# EAGLE design atmega2560 (EAGLE 6.1)
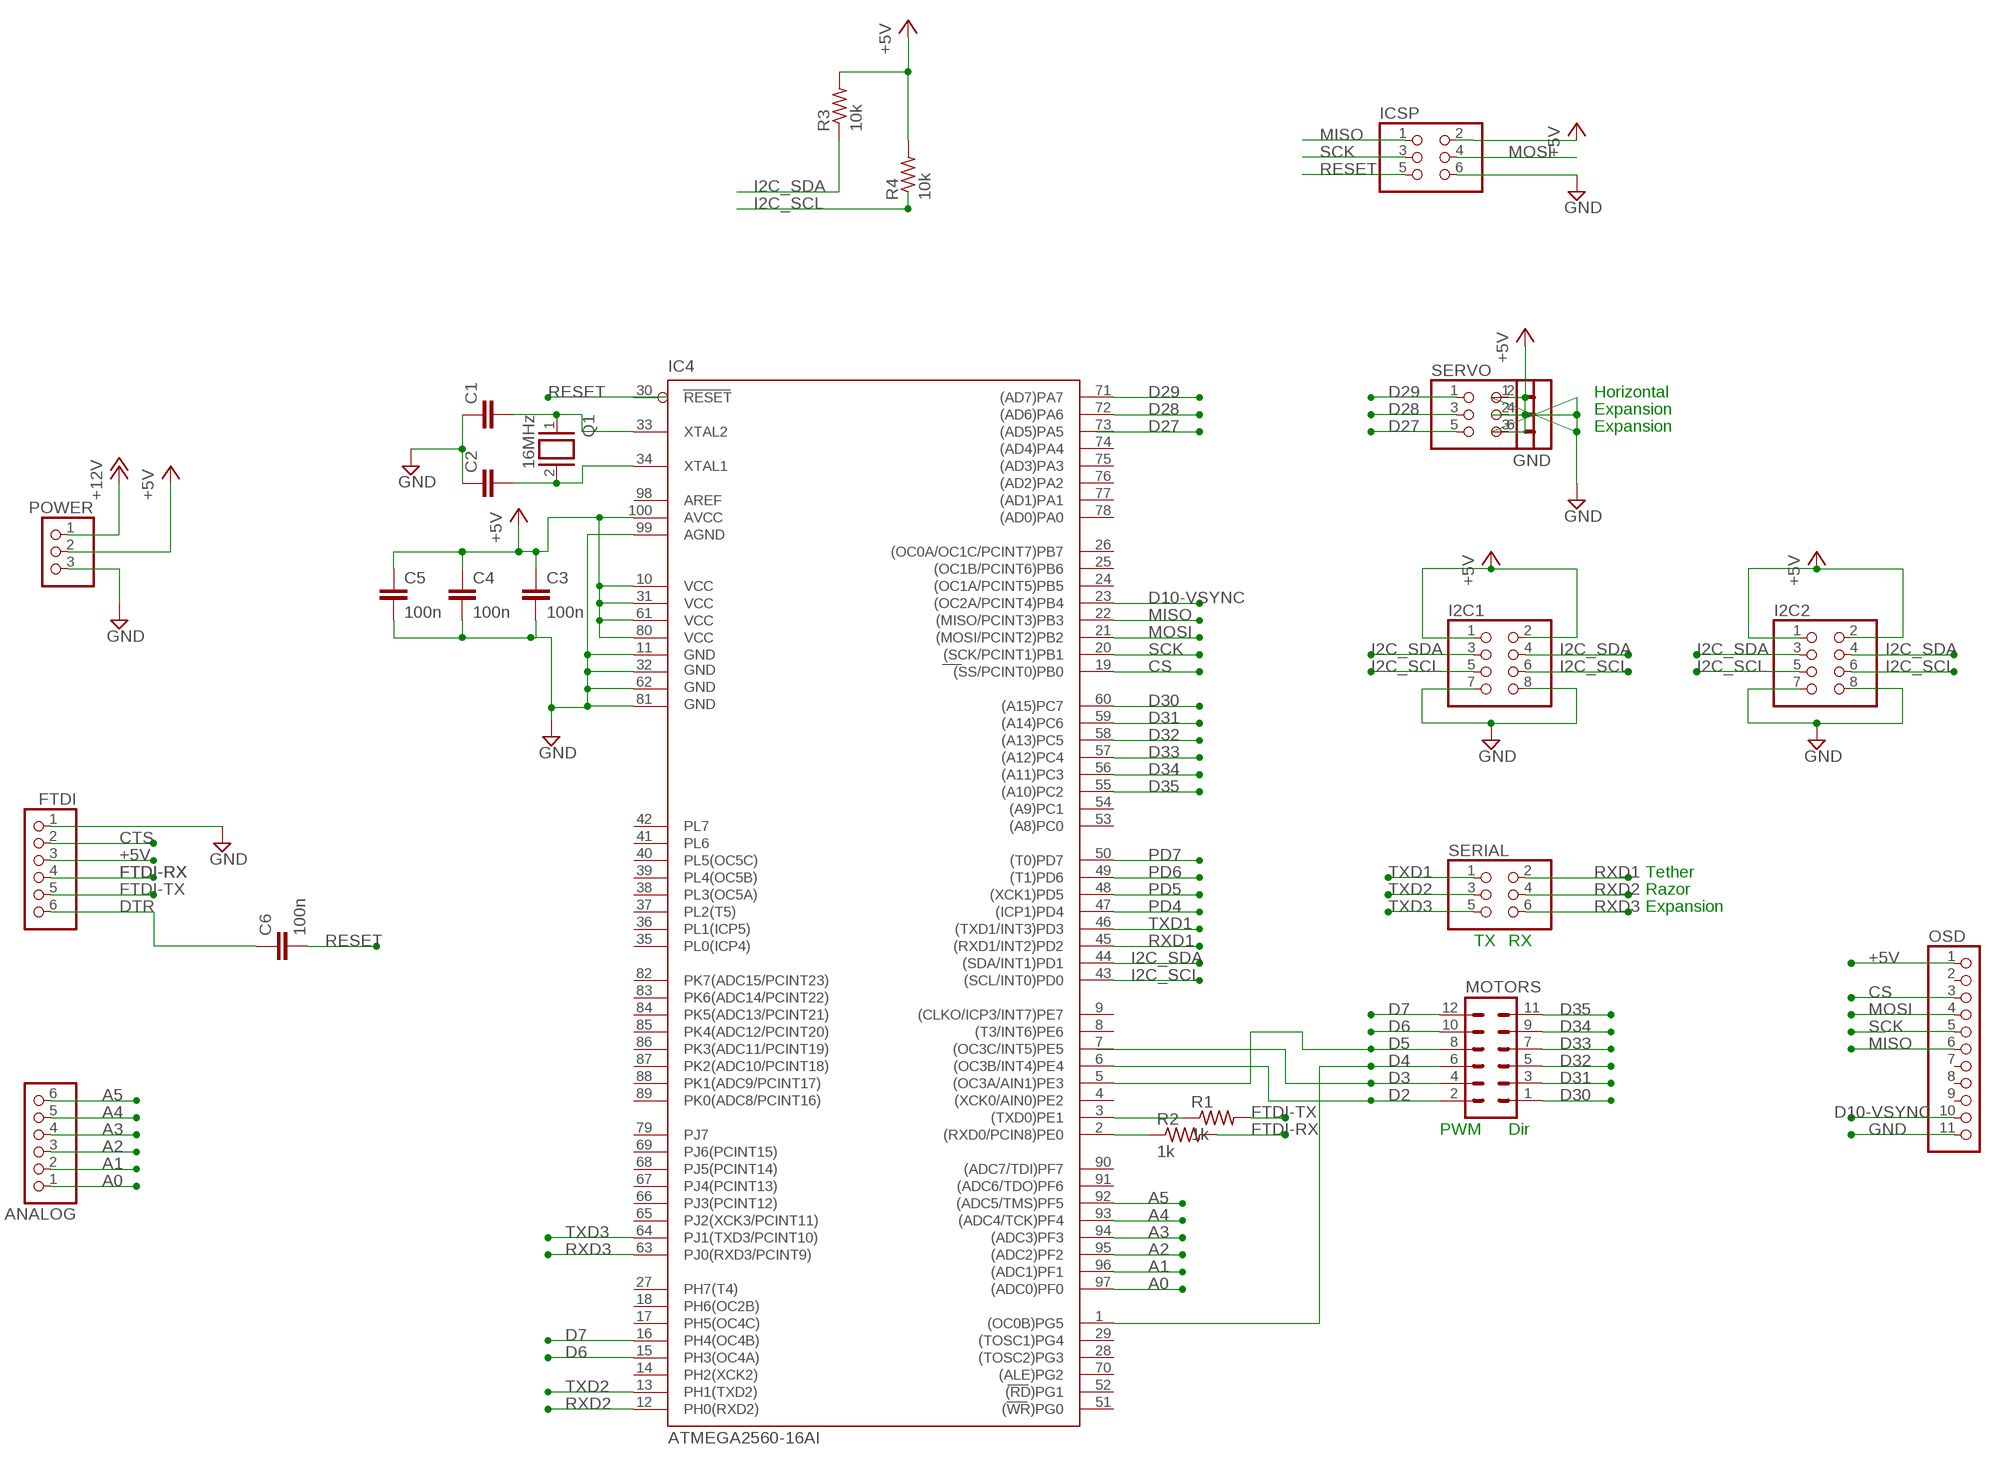
[diagram p0: schematic, sheet 1]

## Parts
ANALOG  PINHD-1X6  [1X06]
C1  C5/3.5  [C5B3.5]
C2  C5/3.5  [C5B3.5]
C3  100n  C5/3.5  [C5B3.5]
C4  100n  C5/3.5  [C5B3.5]
C5  100n  C5/3.5  [C5B3.5]
C6  100n  C-EU050-030X075  [C050-030X075]
FTDI  PINHD-1X6  [1X06]
GND  MA03-1  [MA03-1]
I2C1  PINHD-2X4  [2X04]
I2C2  PINHD-2X4  [2X04]
IC4  ATMEGA2560-16AI  [TQFP100]
ICSP  PINHD-2X3  [2X03]
MOTORS  MA06-2  [MA06-2]
OSD  PINHD-1X11  [1X11]
POWER  PINHD-1X3  [1X03]
Q1  16MHz  XTAL/S  [QS]
R1  1k  R-US_0207/7  [0207/7]
R2  1k  R-US_0207/7  [0207/7]
R3  10k  R-US_0207/7  [0207/7]
R4  10k  R-US_0207/7  [0207/7]
SERIAL  PINHD-2X3  [2X03]
SERVO  PINHD-2X3  [2X03]

## Nets
+5V: C3.1 C4.1 C5.1 FTDI.3 I2C1.1 I2C1.2 I2C2.1 I2C2.2 IC4.10(VCC) IC4.31(VCC1) IC4.61(VCC2) IC4.80(VCC3) IC4.100(AVCC) ICSP.2 OSD.1 POWER.2 R3.2 R4.2 SERVO.2 SERVO.4 SERVO.6
+12V: POWER.1
A0: ANALOG.1 IC4.97((ADC0)PF0)
A1: ANALOG.2 IC4.96((ADC1)PF1)
A2: ANALOG.3 IC4.95((ADC2)PF2)
A3: ANALOG.4 IC4.94((ADC3)PF3)
A4: ANALOG.5 IC4.93((ADC4/TCK)PF4)
A5: ANALOG.6 IC4.92((ADC5/TMS)PF5)
CS: IC4.19((SS/PCINT0)PB0) OSD.3
CTS: FTDI.2
D2: IC4.6((OC3B/INT4)PE4) MOTORS.2
D3: MOTORS.4
D4: IC4.1((OC0B)PG5) MOTORS.6
D5: IC4.5((OC3A/AIN1)PE3) MOTORS.8
D6: IC4.15(PH3(OC4A)) MOTORS.10
D7: IC4.16(PH4(OC4B)) MOTORS.12
D10-VSYNC: IC4.23((OC2A/PCINT4)PB4) OSD.10
D27: SERVO.5
D28: IC4.72((AD6)PA6) SERVO.3
D29: IC4.71((AD7)PA7) SERVO.1
D30: IC4.60((A15)PC7) MOTORS.1
D31: IC4.59((A14)PC6) MOTORS.3
D32: IC4.58((A13)PC5) MOTORS.5
D33: IC4.57((A12)PC4) MOTORS.7
D34: IC4.56((A11)PC3) MOTORS.9
D35: IC4.55((A10)PC2) MOTORS.11
DTR: C6.1 FTDI.6
FTDI-RX: FTDI.4 R2.2
FTDI-TX: FTDI.5 R1.2
GND: C1.1 C2.1 C3.2 C4.2 C5.2 FTDI.1 GND.1 GND.2 GND.3 I2C1.7 I2C1.8 I2C2.7 I2C2.8 IC4.11(GND) IC4.32(GND1) IC4.62(GND2) IC4.81(GND3) IC4.99(AGND) ICSP.6 OSD.11 POWER.3
I2C_SCL: I2C1.5 I2C1.6 I2C2.5 I2C2.6 IC4.43((SCL/INT0)PD0) R4.1
I2C_SDA: I2C1.3 I2C1.4 I2C2.3 I2C2.4 IC4.44((SDA/INT1)PD1) R3.1
MISO: IC4.22((MISO/PCINT3)PB3) ICSP.1 OSD.6
MOSI: IC4.21((MOSI/PCINT2)PB2) ICSP.4 OSD.4
N$1: C1.2 IC4.33(XTAL2) Q1.1
N$2: C2.2 IC4.34(XTAL1) Q1.2
N$3: IC4.2((RXD0/PCIN8)PE0) R2.1
N$4: IC4.3((TXD0)PE1) R1.1
PD4: IC4.47((ICP1)PD4)
PD5: IC4.48((XCK1)PD5)
PD6: IC4.49((T1)PD6)
PD7: IC4.50((T0)PD7)
RESET: C6.2 ICSP.5
RXD1: IC4.45((RXD1/INT2)PD2) SERIAL.2
RXD2: IC4.12(PH0(RXD2)) SERIAL.4
RXD3: IC4.63(PJ0(RXD3/PCINT9)) SERIAL.6
SCK: IC4.20((SCK/PCINT1)PB1) ICSP.3 OSD.5
TXD1: IC4.46((TXD1/INT3)PD3) SERIAL.1
TXD2: IC4.13(PH1(TXD2)) SERIAL.3
TXD3: IC4.64(PJ1(TXD3/PCINT10)) SERIAL.5
Unconnected: IC4.4((XCK0/AIN0)PE2) IC4.7((OC3C/INT5)PE5) IC4.8((T3/INT6)PE6) IC4.9((CLKO/ICP3/INT7)PE7) IC4.14(PH2(XCK2)) IC4.17(PH5(OC4C)) IC4.18(PH6(OC2B)) IC4.24((OC1A/PCINT5)PB5) IC4.25((OC1B/PCINT6)PB6) IC4.26((OC0A/OC1C/PCINT7)PB7) IC4.27(PH7(T4)) IC4.28((TOSC2)PG3) IC4.29((TOSC1)PG4) IC4.30(RESET) IC4.35(PL0(ICP4)) IC4.36(PL1(ICP5)) IC4.37(PL2(T5)) IC4.38(PL3(OC5A)) IC4.39(PL4(OC5B)) IC4.40(PL5(OC5C)) IC4.41(PL6) IC4.42(PL7) IC4.51((WR)PG0) IC4.52((RD)PG1) IC4.53((A8)PC0) IC4.54((A9)PC1) IC4.65(PJ2(XCK3/PCINT11)) IC4.66(PJ3(PCINT12)) IC4.67(PJ4(PCINT13)) IC4.68(PJ5(PCINT14)) IC4.69(PJ6(PCINT15)) IC4.70((ALE)PG2) IC4.73((AD5)PA5) IC4.74((AD4)PA4) IC4.75((AD3)PA3) IC4.76((AD2)PA2) IC4.77((AD1)PA1) IC4.78((AD0)PA0) IC4.79(PJ7) IC4.82(PK7(ADC15/PCINT23)) IC4.83(PK6(ADC14/PCINT22)) IC4.84(PK5(ADC13/PCINT21)) IC4.85(PK4(ADC12/PCINT20)) IC4.86(PK3(ADC11/PCINT19)) IC4.87(PK2(ADC10/PCINT18)) IC4.88(PK1(ADC9/PCINT17)) IC4.89(PK0(ADC8/PCINT16)) IC4.90((ADC7/TDI)PF7) IC4.91((ADC6/TDO)PF6) IC4.98(AREF) OSD.2 OSD.7 OSD.8 OSD.9

## Notes on the sheet
- Horizontal
- Expansion
- Expansion
- Tether
- Razor
- Expansion
- TX | RX
- PWM | Dir

## Library data of the parts
ANALOG FTDI = pinhead:PINHD-1X6: PIN HEADER
C1-C5 = capacitor-wima:C: CAPACITOR naming: grid - package width
C6 = rcl:C-EU: CAPACITOR, European symbol
GND = con-lstb:MA03-1: PIN HEADER; OC_FARNELL: unknown; OC_NEWARK: unknown
I2C1 I2C2 = pinhead:PINHD-2X4: PIN HEADER
IC4 = atmel-2005:ATMEGA*: MICROCONTROLLER 64/128/256 Kbytes FLASH 4 Kbytes EEPROM 8 Kbytes SRAM 86 General Purpose I/O pins 12-channels16-bit PWM 4 x Serial USARTs 16-channels 10-bit A/D
ICSP SERIAL SERVO = pinhead:PINHD-2X3: PIN HEADER
MOTORS = con-lstb:MA06-2: PIN HEADER; OC_FARNELL: unknown; OC_NEWARK: unknown
OSD = pinhead:PINHD-1X11: PIN HEADER
POWER = pinhead:PINHD-1X3: PIN HEADER
Q1 = special:XTAL/S: CRYSTAL
R1-R4 = resistor:R-US_: RESISTOR, American symbol

## Board
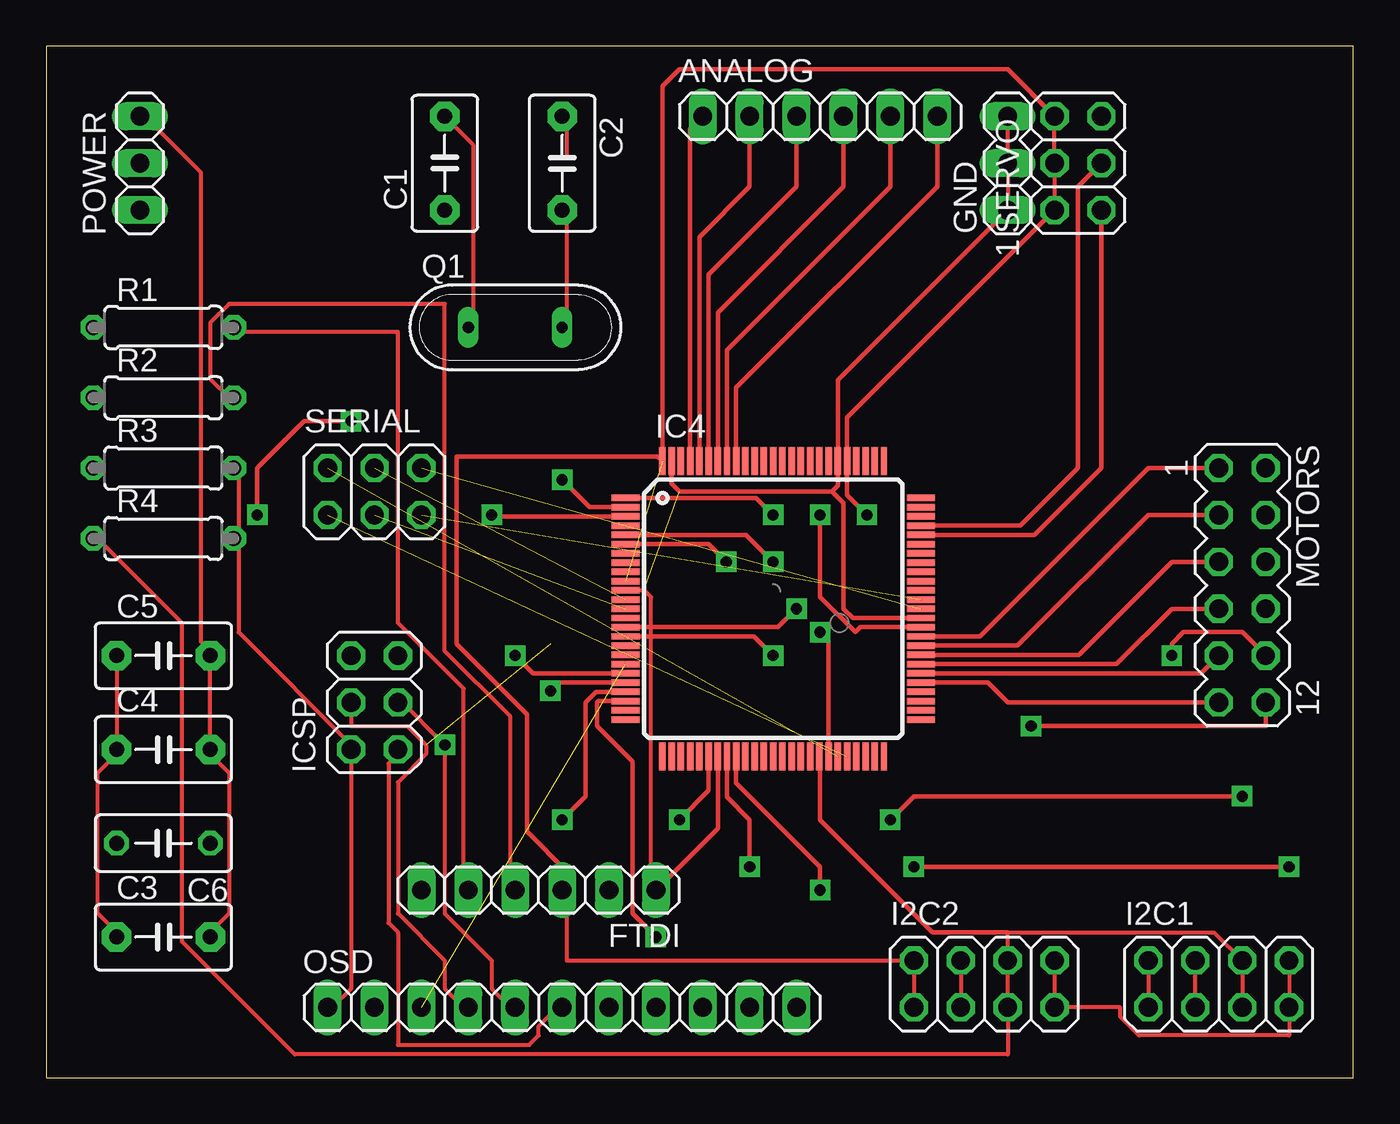
[diagram p1: board, top side]
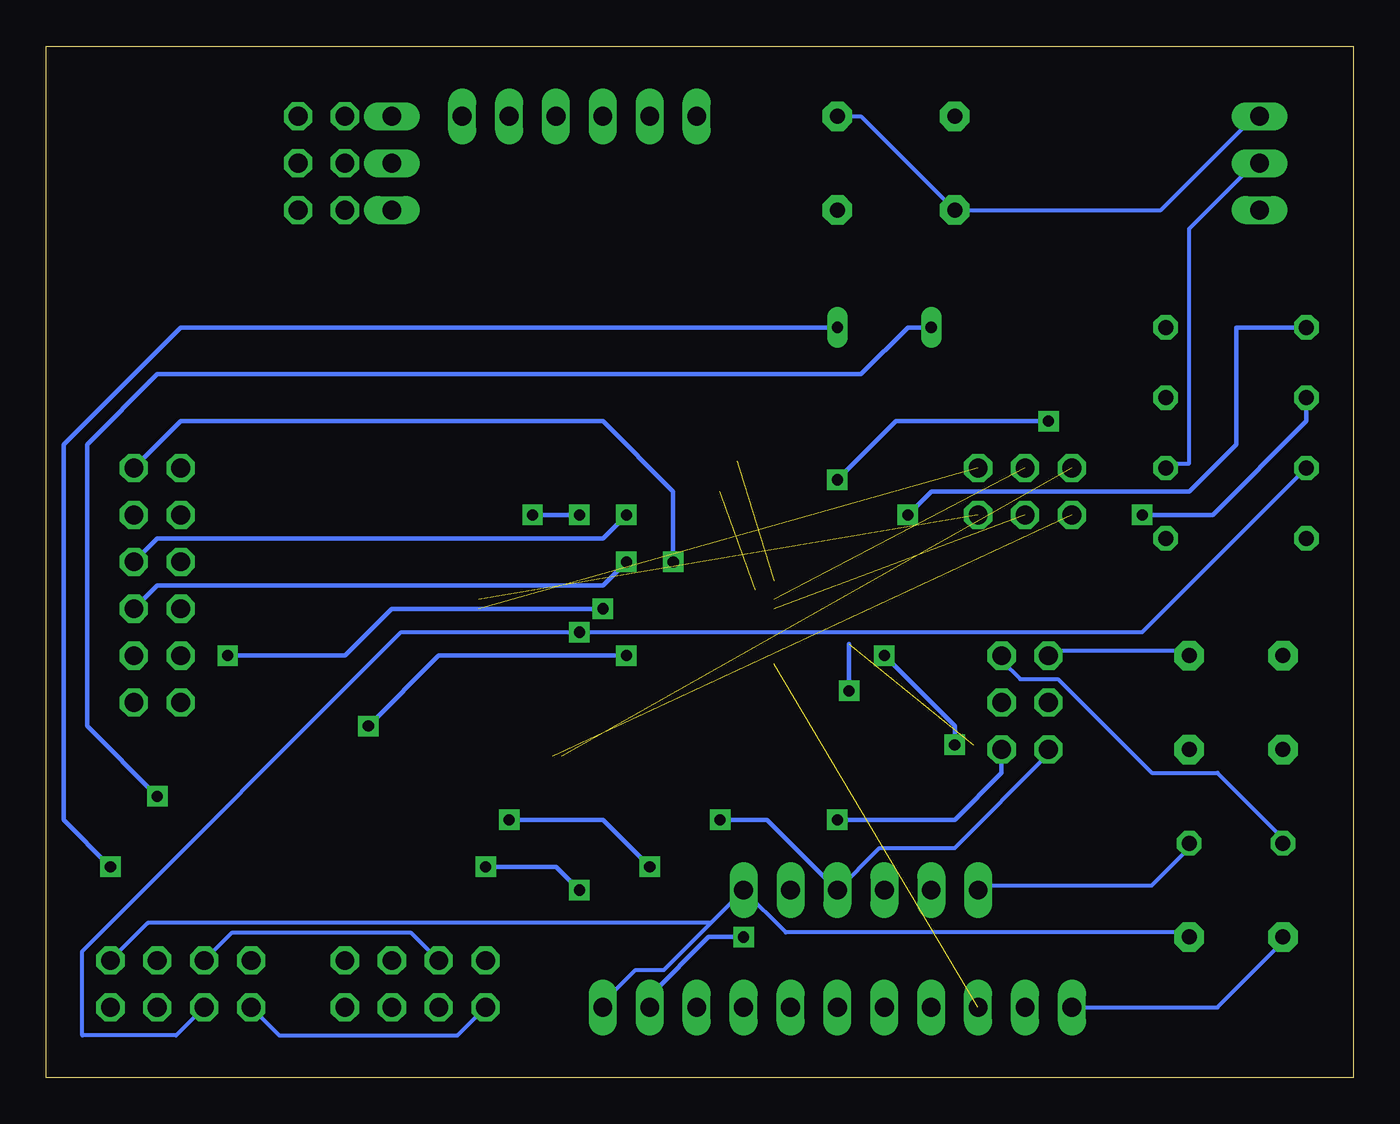
[diagram p2: board, bottom side, seen from below]

Size 70.79 x 55.87 mm. Coordinates in mm from the lower left corner, seen from the top.
Outline: 0,0 70.79,0 70.79,55.87 0,55.87 0,0
Copper layers (1*16): Top 0.035mm / dielectric 1.5mm / Bottom 0.035mm
Design rules: minimum track width 8mil, minimum drill 20mil, track to track 8mil, track to pad 8mil, pad to pad 8mil, via to via 8mil, smd to smd 8mil, copper to edge 10mil, drill to drill 8mil, minimum pad ring 10mil, minimum via ring 10mil, stop-mask expansion 4mil, vias tented up to drill 25mil, thermal gap 10mil

### Footprints (pad centres in the part's own frame; a part is rotated, then mirrored left to right if it is on the bottom)
1X06 = drill 1.016 long: 1 -6.35,0; 2 -3.81,0; 3 -1.27,0; 4 1.27,0; 5 3.81,0; 6 6.35,0
C5B3.5 = drill 0.813 pad 1.6 octagon: 1 -2.54,0; 2 2.54,0
C050-030X075 = drill 0.813 octagon: 1 -2.54,0; 2 2.54,0
MA03-1 = drill 1.016 long: 1 -2.54,0; 2 0,0; 3 2.54,0
2X04 = drill 1.016 octagon: 1 -3.81,-1.27; 2 -3.81,1.27; 3 -1.27,-1.27; 4 -1.27,1.27; 5 1.27,-1.27; 6 1.27,1.27; 7 3.81,-1.27; 8 3.81,1.27
TQFP100 = smd 1.5 x 0.35: 1 -8,6; 2 -8,5.5; 3 -8,5; 4 -8,4.5; 5 -8,4; 6 -8,3.5; 7 -8,3; 8 -8,2.5; 9 -8,2; 10 -8,1.5; 11 -8,1; 12 -8,0.5; 13 -8,0; 14 -8,-0.5; 15 -8,-1; 16 -8,-1.5; 17 -8,-2; 18 -8,-2.5; 19 -8,-3; 20 -8,-3.5; 21 -8,-4; 22 -8,-4.5; 23 -8,-5; 24 -8,-5.5; 25 -8,-6; 51 8,-6; 52 8,-5.5; 53 8,-5; 54 8,-4.5; 55 8,-4; 56 8,-3.5; 57 8,-3; 58 8,-2.5; 59 8,-2; 60 8,-1.5; 61 8,-1; 62 8,-0.5; 63 8,0; 64 8,0.5; 65 8,1; 66 8,1.5; 67 8,2; 68 8,2.5; 69 8,3; 70 8,3.5; 71 8,4; 72 8,4.5; 73 8,5; 74 8,5.5; 75 8,6 | smd 0.35 x 1.5: 26 -6,-8; 27 -5.5,-8; 28 -5,-8; 29 -4.5,-8; 30 -4,-8; 31 -3.5,-8; 32 -3,-8; 33 -2.5,-8; 34 -2,-8; 35 -1.5,-8; 36 -1,-8; 37 -0.5,-8; 38 0,-8; 39 0.5,-8; 40 1,-8; 41 1.5,-8; 42 2,-8; 43 2.5,-8; 44 3,-8; 45 3.5,-8; 46 4,-8; 47 4.5,-8; 48 5,-8; 49 5.5,-8; 50 6,-8; 76 6,8; 77 5.5,8; 78 5,8; 79 4.5,8; 80 4,8; 81 3.5,8; 82 3,8; 83 2.5,8; 84 2,8; 85 1.5,8; 86 1,8; 87 0.5,8; 88 0,8; 89 -0.5,8; 90 -1,8; 91 -1.5,8; 92 -2,8; 93 -2.5,8; 94 -3,8; 95 -3.5,8; 96 -4,8; 97 -4.5,8; 98 -5,8; 99 -5.5,8; 100 -6,8
2X03 = drill 1.016 octagon: 1 -2.54,-1.27; 2 -2.54,1.27; 3 0,-1.27; 4 0,1.27; 5 2.54,-1.27; 6 2.54,1.27
MA06-2 = drill 1.016 octagon: 1 -6.35,-1.27; 2 -6.35,1.27; 3 -3.81,-1.27; 4 -3.81,1.27; 5 -1.27,-1.27; 6 -1.27,1.27; 7 1.27,-1.27; 8 1.27,1.27; 9 3.81,-1.27; 10 3.81,1.27; 11 6.35,-1.27; 12 6.35,1.27
1X11 = drill 1.016 long: 1 -12.7,0; 2 -10.16,0; 3 -7.62,0; 4 -5.08,0; 5 -2.54,0; 6 0,0; 7 2.54,0; 8 5.08,0; 9 7.62,0; 10 10.16,0; 11 12.7,0
1X03 = drill 1.016 long: 1 -2.54,0; 2 0,0; 3 2.54,0
QS = drill 0.61 long: 1 -2.54,0; 2 2.54,0
0207/7 = drill 0.813 octagon: 1 -3.81,0; 2 3.81,0

### Placement (x,y rotation side)
ANALOG  41.91,52.07 0 top
C1  21.59,49.53 90 top
C2  27.94,49.53 270 top
C3  6.35,7.62 0 top
C4  6.35,17.78 0 top
C5  6.35,22.86 0 top
C6  6.35,12.7 180 top
FTDI  26.67,10.16 180 top
GND  52.07,49.53 90 top
I2C1  63.5,5.08 0 top
I2C2  50.8,5.08 0 top
IC4  39.37,25.4 0 top
ICSP  17.78,20.32 90 top
MOTORS  64.77,26.67 270 top
OSD  27.94,3.81 0 top
POWER  5.08,49.53 90 top
Q1  25.4,40.64 0 top
R1  6.35,40.64 0 top
R2  6.35,36.83 0 top
R3  6.35,33.02 0 top
R4  6.35,29.21 0 top
SERIAL  17.78,31.75 0 top
SERVO  55.88,49.53 90 top

### Tracks (layer width: path | path; a pad name or v marks a point on that pad's centre or on a via)
+5V  (via drill 0.6)  (1 unrouted)
  Top 0.203: C5.1 C4.1 3.81,17.53 2.79,16.51 2.79,8.89 3.81,7.87 C3.1 | 10.41,29.21 10.41,32.77 R3.2 | 10.41,29.21 10.41,24.13 16.51,18.03 ICSP.2 16.51,4.83 15.49,3.81 OSD.1 | 10.41,29.21 R4.2 | I2C2.1 I2C2.2 28.19,6.35 28.19,9.91 FTDI.3 28.19,10.41 | I2C1.2 I2C1.1 | SERVO.2 SERVO.4 SERVO.6
  Top 0.254: SERVO.6 52.07,54.61 34.29,54.61 33.37,53.69 IC4.100 33.12,33.66 22.23,33.66 22.23,23.5 26.04,19.69 26.04,13.33 28.19,11.18 28.19,10.41 | SERVO.2 43.37,35.75 IC4.80 43.37,31.56 v44.45,30.48 | IC4.31 35.87,15.55 v34.29,13.97 | v41.91,30.48 41.91,26.04 43.81,24.13 44.09,24.4 IC4.61
  Bottom 0.203: OSD.1 7.37,3.81 3.81,7.37 C3.1 | POWER.2 5.33,49.53 8.89,45.97 8.89,33.27 9.91,33.27 R3.2 | I2C2.1 48.51,2.29 58.17,2.29 I2C1.1 | FTDI.3 25.65,12.45 21.59,12.45 16.51,17.53 ICSP.2
  Bottom 0.254: v34.29,13.97 31.75,13.97 FTDI.3 | v44.45,30.48 v41.91,30.48
A0
  Top 0.254: IC4.97 34.87,51.38 ANALOG.1
A1
  Top 0.254: IC4.96 35.37,45.53 38.1,48.26 ANALOG.2
A2
  Top 0.254: IC4.95 35.87,43.49 40.64,48.26 ANALOG.3
A3
  Top 0.254: IC4.94 36.37,41.45 43.18,48.26 ANALOG.4
A4
  Top 0.254: IC4.93 36.87,39.41 45.72,48.26 ANALOG.5
A5
  Top 0.254: IC4.92 37.37,37.37 48.26,48.26 ANALOG.6
CS  (1 unrouted)
D2  (via drill 0.6)
  Top 0.254: IC4.6 35.87,28.9 v36.83,27.94
  Bottom 0.254: v36.83,27.94 36.83,31.75 40.64,35.56 63.5,35.56 MOTORS.2
D4  (via drill 0.6)
  Top 0.254: IC4.1 38.45,31.4 v39.37,30.48
  Bottom 0.254: MOTORS.6 64.77,29.21 40.64,29.21 v39.37,30.48
D5  (via drill 0.6)
  Top 0.254: IC4.5 37.91,29.4 v39.37,27.94
  Bottom 0.254: MOTORS.8 64.77,26.67 40.64,26.67 v39.37,27.94
D6  (via drill 0.6)
  Top 0.254: MOTORS.10 64.77,24.13 61.6,24.13 60.96,23.5 v60.96,22.86 | IC4.15 39.64,24.4 v40.64,25.4
  Bottom 0.254: v60.96,22.86 54.61,22.86 52.07,25.4 v40.64,25.4
D7  (via drill 0.6)
  Top 0.254: MOTORS.12 66.04,19.05 v53.34,19.05 | IC4.16 38.33,23.9 v39.37,22.86
  Bottom 0.254: v53.34,19.05 49.53,22.86 v39.37,22.86
D10-VSYNC  (via drill 0.6)
  Top 0.254: IC4.23 29.92,20.4 29.84,20.32 29.84,19.05 31.75,17.14 31.75,8.89 v33.02,7.62
  Bottom 0.254: OSD.10 38.1,4.44 34.92,7.62 v33.02,7.62
D28
  Top 0.254: IC4.72 52.76,29.9 55.88,33.02 55.88,48.26 SERVO.3
D29
  Top 0.254: IC4.71 53.53,29.4 57.15,33.02 SERVO.1
D30
  Top 0.254: IC4.60 50.57,23.9 59.69,33.02 MOTORS.1
D31
  Top 0.254: IC4.59 52.61,23.4 59.69,30.48 MOTORS.3
D32
  Top 0.254: IC4.58 55.92,22.9 60.96,27.94 MOTORS.5
D33
  Top 0.254: IC4.57 57.96,22.4 60.96,25.4 MOTORS.7
D34
  Top 0.254: IC4.56 62.54,21.9 MOTORS.9
D35
  Top 0.254: IC4.55 50.99,21.4 52.07,20.32 MOTORS.11
DTR
  Bottom 0.203: C6.1 8.89,12.45 10.92,10.41 20.07,10.41 FTDI.6
FTDI-RX
  Top 0.203: R2.2 9.91,36.83 8.89,37.85 8.89,40.89 9.91,41.91 21.59,41.91 21.59,23.11 25.15,19.56 25.15,10.41 FTDI.4
FTDI-TX
  Top 0.203: R1.2 10.41,40.39 19.05,40.39 19.05,24.64 22.61,21.08 22.61,10.41 FTDI.5
GND  (1 unrouted)
  Top 0.203: GND.1 GND.2 GND.3 | 28.19,50.04 28.19,52.07 C2.1 | I2C2.8 I2C2.7 58.17,3.81 58.17,3.3 59.18,2.29 67.31,2.29 I2C1.7 I2C1.8 | C3.2 8.89,7.87 9.91,8.89 9.91,16.51 8.89,17.53 C4.2 C5.2 8.89,23.11 8.38,23.62 8.38,49.02 5.33,52.07 POWER.3 | 47.24,24.89 IC4.62 | IC4.11 31.62,26.42 32.38,26.42 32.77,26.04 32.77,10.41 FTDI.1
  Top 0.254: IC4.99 33.87,32.17 34.29,31.75 42.55,31.75 | 42.55,31.75 42.87,32.08 IC4.81 42.87,37.79 GND.1 | IC4.32 36.37,13.51 FTDI.1 | 47.24,24.89 43.69,24.89 43.18,25.4 43.18,31.12 42.55,31.75
  Bottom 0.203: C2.1 26.67,52.07 C1.1 10.41,46.99 5.33,52.07 POWER.3 | 34.8,8.38 37.34,5.84 38.86,5.84 40.89,3.81 OSD.11 | 34.8,8.38 FTDI.1 30.73,7.87 8.89,7.87 C3.2 | ICSP.6 16.51,23.11 8.89,23.11 C5.2 | I2C1.8 65.28,8.38 34.8,8.38
I2C_SCL
  Top 0.203: I2C1.5 I2C1.6 63.25,7.87 52.07,7.87 I2C2.6 I2C2.5 52.07,1.27 13.46,1.27 7.37,7.37 7.37,24.64 2.79,29.21 R4.1
  Top 0.254: 52.07,7.87 48.01,7.87 41.91,13.97 41.91,17.36 IC4.43
I2C_SDA  (via drill 0.6)
  Top 0.203: I2C2.4 I2C2.3 | I2C1.3 I2C1.4
  Top 0.254: IC4.44 42.37,23.67 v41.91,24.13
  Bottom 0.203: R3.1 11.43,24.13 v41.91,24.13 51.56,24.13 68.83,6.86 68.83,2.29 63.75,2.29 I2C1.3 | I2C2.4 51.05,7.87 60.71,7.87 I2C1.4
MISO  (via drill 0.6)
  Top 0.203: OSD.6 27.69,3.81 26.67,2.79 26.67,2.29 26.16,1.78 19.05,1.78 19.05,7.87 18.54,8.38 18.54,17.02 19.05,17.53 ICSP.1
  Top 0.254: IC4.22 29.79,20.9 29.21,20.32 29.21,15.24 v27.94,13.97
  Bottom 0.254: ICSP.1 19.05,16.51 21.59,13.97 v27.94,13.97
MOSI  (via drill 0.6)  (1 unrouted)
  Top 0.203: ICSP.4 16.51,19.05 19.56,19.05 20.57,18.03 20.57,17.53 19.05,16 19.05,8.89 21.59,6.35 21.59,4.83 22.61,3.81 OSD.4
  Top 0.254: 31.56,21.4 IC4.21 27.75,21.4 v27.3,20.95
  Bottom 0.254: v27.3,20.95 27.3,23.5
N$1  (via drill 0.6)
  Top 0.203: C1.2 23.11,50.55 23.11,40.89 Q1.1
  Top 0.254: v64.77,15.24 46.99,15.24 v45.72,13.97 | IC4.33 36.87,15.2 38.1,13.97 v38.1,11.43
  Bottom 0.254: Q1.1 24.13,40.64 26.67,38.1 64.77,38.1 68.58,34.29 68.58,19.05 v64.77,15.24 | v45.72,13.97 40.64,13.97 v38.1,11.43
N$2  (via drill 0.6)
  Top 0.203: Q1.2 28.19,40.89 28.19,46.99 C2.2
  Top 0.254: v67.31,11.43 v46.99,11.43 | IC4.34 37.37,15.97 41.91,11.43 v41.91,10.16
  Bottom 0.254: Q1.2 63.5,40.64 69.85,34.29 69.85,13.97 v67.31,11.43 | v46.99,11.43 43.18,11.43 v41.91,10.16
N$3  (via drill 0.6)
  Top 0.254: v11.43,30.48 11.43,33.02 13.97,35.56 v16.51,35.56 | IC4.2 29.42,30.9 v27.94,32.38
  Bottom 0.254: R2.1 2.54,35.56 7.62,30.48 v11.43,30.48 | v16.51,35.56 24.77,35.56 v27.94,32.38
N$4  (via drill 0.6)
  Top 0.254: IC4.3 24.21,30.4 v24.13,30.48
  Bottom 0.254: R1.1 6.35,40.64 6.35,34.29 8.89,31.75 22.86,31.75 v24.13,30.48
RESET
  Bottom 0.203: C6.2 3.81,12.95 7.37,16.51 10.92,16.51 16,21.59 18.03,21.59 19.05,22.61 ICSP.5
RXD1  (1 unrouted)
RXD2  (1 unrouted)
RXD3  (1 unrouted)
SCK  (via drill 0.6)
  Top 0.203: OSD.5 25.15,3.81 24.13,4.83 24.13,6.35 21.59,8.89 v21.59,18.03 19.05,20.57 ICSP.3
  Top 0.254: IC4.20 26.36,21.9 v25.4,22.86
  Bottom 0.254: v21.59,18.03 21.59,19.05 v25.4,22.86
TXD1  (1 unrouted)
TXD2  (1 unrouted)
TXD3  (1 unrouted)